# Altium schematic sheet FPC-ETH-DualRJ45.SchDoc
size A4; SheetNumber: 13; SheetTotal: 15
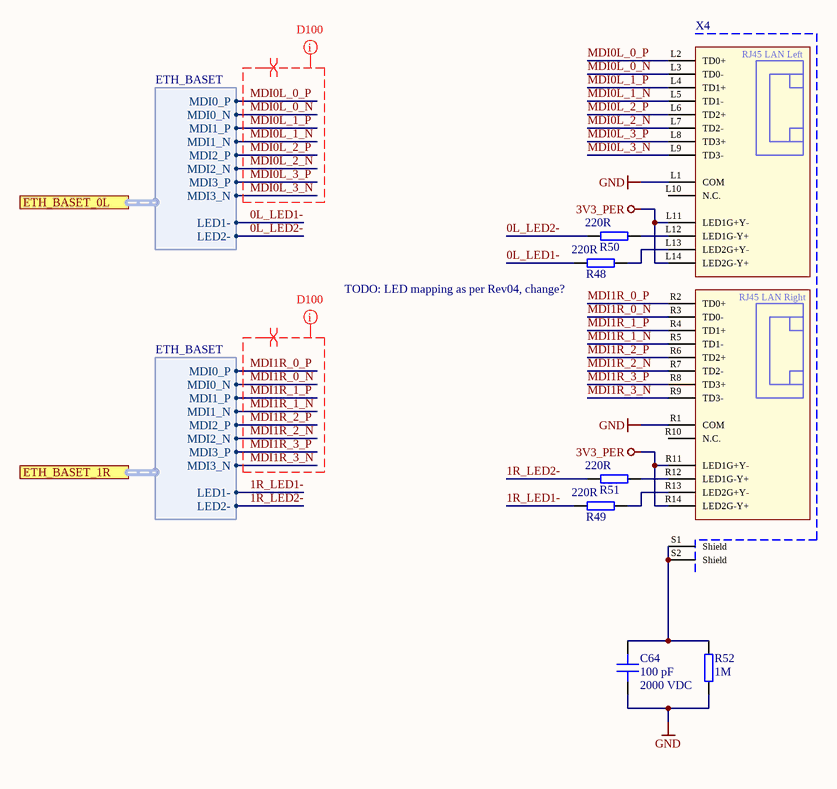
[diagram p0: FPC-ETH-DualRJ45.SchDoc]

## Parts
C64  100 pF  Voltage Rating: 2000 VDC  [C_1206_TE]
R48  220R  [R_0603_TE]
R49  220R  [R_0603_TE]
R50  220R  [R_0603_TE]
R51  220R  [R_0603_TE]
R52  1M  [RES 1206_3216]
X4  (no value)  [74991214400]

## Ports
ETH_BASET_0L (harness ETH_BASET), ETH_BASET_1R (harness ETH_BASET)

## Harnesses
ETH_BASET: MDI0_P, MDI0_N, MDI1_P, MDI1_N, MDI2_P, MDI2_N, MDI3_P, MDI3_N, LED1-, LED2-

## Nets
3V3_PER: X4.L11(LED1G+Y-) X4.L14(LED2G-Y+) X4.R11(LED1G+Y-) X4.R14(LED2G-Y+)
GND: C64.1 R52.1 X4.L1(COM) X4.R1(COM)
0L_LED1-: R48.1 ; port ETH_BASET_0L.LED1-
0L_LED2-: R50.1 ; port ETH_BASET_0L.LED2-
1R_LED1-: R49.1 ; port ETH_BASET_1R.LED1-
1R_LED2-: R51.1 ; port ETH_BASET_1R.LED2-
MDI0L_0_N: X4.L3(TD0-) ; port ETH_BASET_0L.MDI0_N
MDI0L_0_P: X4.L2(TD0+) ; port ETH_BASET_0L.MDI0_P
MDI0L_1_N: X4.L5(TD1-) ; port ETH_BASET_0L.MDI1_N
MDI0L_1_P: X4.L4(TD1+) ; port ETH_BASET_0L.MDI1_P
MDI0L_2_N: X4.L7(TD2-) ; port ETH_BASET_0L.MDI2_N
MDI0L_2_P: X4.L6(TD2+) ; port ETH_BASET_0L.MDI2_P
MDI0L_3_N: X4.L9(TD3-) ; port ETH_BASET_0L.MDI3_N
MDI0L_3_P: X4.L8(TD3+) ; port ETH_BASET_0L.MDI3_P
MDI1R_0_N: X4.R3(TD0-) ; port ETH_BASET_1R.MDI0_N
MDI1R_0_P: X4.R2(TD0+) ; port ETH_BASET_1R.MDI0_P
MDI1R_1_N: X4.R5(TD1-) ; port ETH_BASET_1R.MDI1_N
MDI1R_1_P: X4.R4(TD1+) ; port ETH_BASET_1R.MDI1_P
MDI1R_2_N: X4.R7(TD2-) ; port ETH_BASET_1R.MDI2_N
MDI1R_2_P: X4.R6(TD2+) ; port ETH_BASET_1R.MDI2_P
MDI1R_3_N: X4.R9(TD3-) ; port ETH_BASET_1R.MDI3_N
MDI1R_3_P: X4.R8(TD3+) ; port ETH_BASET_1R.MDI3_P
NetC64_2: C64.2 R52.2 X4.S1(Shield) X4.S2(Shield)
NetR48_2: R48.2 X4.L13(LED2G+Y-)
NetR49_2: R49.2 X4.R13(LED2G+Y-)
NetR50_2: R50.2 X4.L12(LED1G-Y+)
NetR51_2: R51.2 X4.R12(LED1G-Y+)

Not connected (* = marked no-connect by the designer): X4 L10(N.C.) R10(N.C.)

## Layout directives
differential pair: MDI0L_0_N, MDI0L_0_P, MDI0L_1_N, MDI0L_1_P, MDI0L_2_N, MDI0L_2_P, MDI0L_3_N, MDI0L_3_P, MDI1R_0_N, MDI1R_0_P, MDI1R_1_N, MDI1R_1_P, MDI1R_2_N, MDI1R_2_P, MDI1R_3_N, MDI1R_3_P
net class D100: MDI0L_0_N, MDI0L_0_P, MDI0L_1_N, MDI0L_1_P, MDI0L_2_N, MDI0L_2_P, MDI0L_3_N, MDI0L_3_P, MDI1R_0_N, MDI1R_0_P, MDI1R_1_N, MDI1R_1_P, MDI1R_2_N, MDI1R_2_P, MDI1R_3_N, MDI1R_3_P

## Notes on the sheet
- (near R48) TODO: LED mapping as per Rev04, change?
- Title
- Revision:
- Design Engineer:
- Date:
- Project:
- Sheet
- of
- (in symbol 74991214400) RJ45 LAN Left; RJ45 LAN Right

## Library data of the parts
C64 = CC1206JKNPODBN101: 2kV 100pF NP0 ±5% 1206 Multilayer Ceramic Capacitors MLCC - SMD/SMT ROHS; Manufacturer: YAGEO; Created from: AGeiger; Manufacturer Part Number: CC1206JKNPODBN101; PartID: 115; Created On: 02/12/2022 11:59:53; ComponentLink1Description: Datasheet; ComponentLink1URL: https://datasheet.lcsc.com/lcsc/2108131530_YAGEO-CC1206JKNPODBN101_C113876.pdf; Component Type: Capacitor 1206; Device Package: 1206; Last Updated: 22/04/2025 15:53:45; Mounting Type: SMD; Operating Temperature: -55 to +125°C; Series: NP0; Supplier 1: LCSC; Supplier Part Number 1: C113876; Type: Capacitor; Tolerance: 5 %; Value: 100 pF; Live Cycle Status: 1; LCSC Part Number: C113876
R48-R51 = UZgen_R_0603_220R: Generic resistor; Manufacturer: UZgen; Tolerance: 1 %; Created from: UZgenTool; Manufacturer Part Number: UZgen_R_0603_220R; PartID: 205; Created On: 02/07/2024 17:29:49; Value: 220R; Device Package: 0603; Mounting Type: SMD; Last Updated: 02/07/2024 17:29:49
R52 = 1206W4F1004T5E: 250mW Thick Film Resistors 200V ±100ppm/℃ ±1% -55℃~+155℃ 1MΩ 1206 Chip Resistor - Surface Mount ROHS; Manufacturer: UNI-ROYAL; Created from: AGeiger; Manufacturer Part Number: 1206W4F1004T5E; PartID: 248; Created On: 02.12.2022 11:50:50; ComponentLink1Description: Datasheet; ComponentLink1URL: https://datasheet.lcsc.com/lcsc/2206010145_UNI-ROYAL-Uniroyal-Elec-1206W4F1004T5E_C17927.pdf; Component Type: SMD resistor; Device Package: 1206; Last Updated: 02.12.2022 11:50:50; Mounting Type: SMD; Supplier 1: LCSC; Supplier Part Number 1: C17927; Type: Resistor; Tolerance: 1%; Value: 1M; Live Cycle Status: 1; LCSC Part Number: C17927
X4 = 74991214400: Dual (1x2) 1000BASE-T Ethernet (1-GigE) Connector with downward tabs, ground fingers and dual-green/yellow LEDs per port; Manufacturer: Würth Elektronik; Created from: MGeier; Manufacturer Part Number: 74991214400; PartID: 39; Created On: 31/07/2024 14:15:42; ComponentLink1Description: Datasheet; ComponentLink1URL: https://www.we-online.com/components/products/datasheet/74991214400.pdf; Last Updated: 08/10/2024 12:21:15; Mounting Type: THT; Operating Temperature: -40 up to +85 °C; Series: WE-RJ45 LAN; Supplier 1: DigiKey; Supplier Part Number 1: 732-74991214400-ND; Value: 74991214400; LCSC Part Number: C29641821; ComponentLink2Description: Homepage; ComponentLink2URL: https://www.we-online.com/en/components/products/WE-LAN-RJ45; Supplier 2: Mouser; Supplier Part Number 2: 710-74991214400; Supplier 3: LCSC; Supplier Part Number 3: C29641821